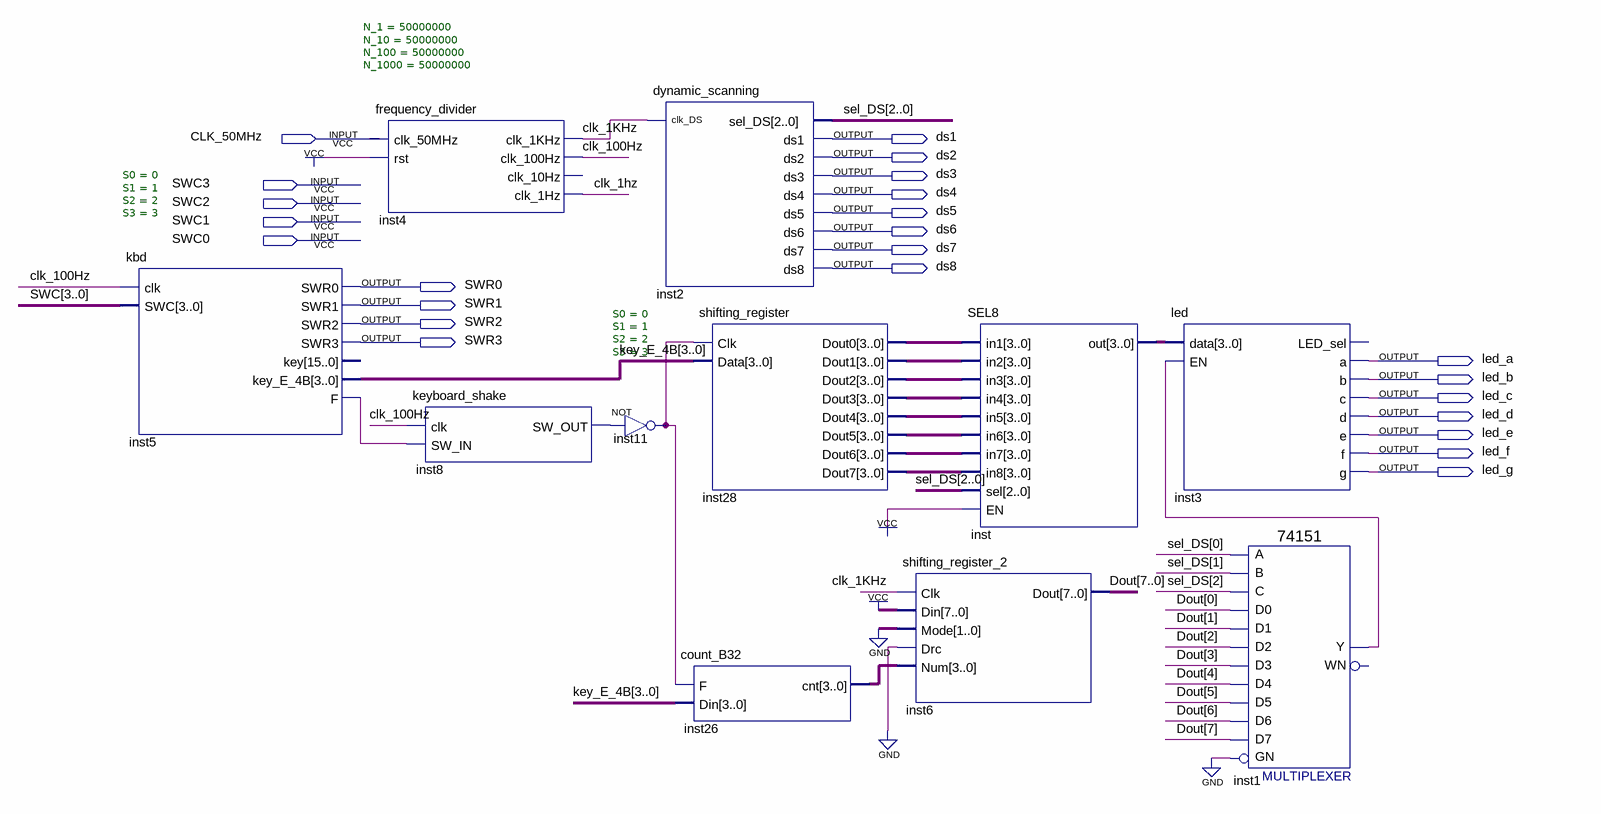
[diagram p0: schematic sheet]
// Quartus schematic project11_2.bdf as structural Verilog: 11 symbols, 24 pins
module project11_2 (
  input  CLK_50MHz,
  input  SWC3,
  input  SWC2,
  input  SWC1,
  input  SWC0,
  output ds1,
  output ds2,
  output ds3,
  output ds4,
  output ds5,
  output ds6,
  output ds7,
  output ds8,
  output SWR0,
  output SWR1,
  output SWR2,
  output SWR3,
  output led_a,
  output led_b,
  output led_c,
  output led_d,
  output led_e,
  output led_f,
  output led_g
);

  wire clk_1hz, clk_1KHz, clk_100Hz, inst1_y, inst5_f, inst8_sw_out, inst11_out;
  wire [2:0] sel_DS;
  wire [3:0] inst26_cnt, inst28_dout0, inst28_dout1, inst28_dout2, inst28_dout3, inst28_dout4, inst28_dout5,
       inst28_dout6, inst28_dout7, inst_out, key_E_4B;
  wire [7:0] Dout;

  kbd #(.S0(0), .S1(1), .S2(2), .S3(3)) inst5 (
    .clk(clk_100Hz), .SWC({SWC3, SWC2, SWC1, SWC0}), .SWR0(SWR0), .SWR1(SWR1), .SWR2(SWR2), .SWR3(SWR3),
    .key_E_4B(key_E_4B), .F(inst5_f));  // open: key
  frequency_divider #(.N_1(50000000), .N_10(50000000), .N_100(50000000), .N_1000(50000000)) inst4 (
    .clk_50MHz(CLK_50MHz), .rst(1'b1), .clk_1KHz(clk_1KHz), .clk_100Hz(clk_100Hz), .clk_1Hz(clk_1hz));  // open: clk_10Hz
  keyboard_shake #(.S0(0), .S1(1), .S2(2), .S3(3)) inst8 (.clk(clk_100Hz), .SW_IN(inst5_f), .SW_OUT(inst8_sw_out));
  not inst11 (inst11_out, inst8_sw_out);
  dynamic_scanning inst2 (
    .clk_DS(clk_1KHz), .sel_DS(sel_DS), .ds1(ds1), .ds2(ds2), .ds3(ds3), .ds4(ds4), .ds5(ds5), .ds6(ds6),
    .ds7(ds7), .ds8(ds8));
  shifting_register inst28 (
    .Clk(inst11_out), .Data(key_E_4B), .Dout0(inst28_dout0), .Dout1(inst28_dout1), .Dout2(inst28_dout2),
    .Dout3(inst28_dout3), .Dout4(inst28_dout4), .Dout5(inst28_dout5), .Dout6(inst28_dout6),
    .Dout7(inst28_dout7));
  count_B32 inst26 (.F(inst11_out), .Din(key_E_4B), .cnt(inst26_cnt));
  shifting_register_2 inst6 (.Clk(clk_1KHz), .Din({8{1'b1}}), .Mode(2'b00), .Drc(1'b0), .Num(inst26_cnt), .Dout(Dout));
  SEL8 inst (
    .in1(inst28_dout0), .in2(inst28_dout1), .in3(inst28_dout2), .in4(inst28_dout3), .in5(inst28_dout4),
    .in6(inst28_dout5), .in7(inst28_dout6), .in8(inst28_dout7), .sel(sel_DS), .EN(1'b1), .out(inst_out));
  led inst3 (
    .data(inst_out), .EN(inst1_y), .a(led_a), .b(led_b), .c(led_c), .d(led_d), .e(led_e), .f(led_f), .g(led_g));  // open: LED_sel
  \74151  inst1 (
    .GN(1'b0), .C(sel_DS[2]), .B(sel_DS[1]), .A(sel_DS[0]), .D5(Dout[5]), .D0(Dout[0]), .D1(Dout[1]),
    .D4(Dout[4]), .D3(Dout[3]), .D2(Dout[2]), .D6(Dout[6]), .D7(Dout[7]), .Y(inst1_y));  // open: WN
endmodule
